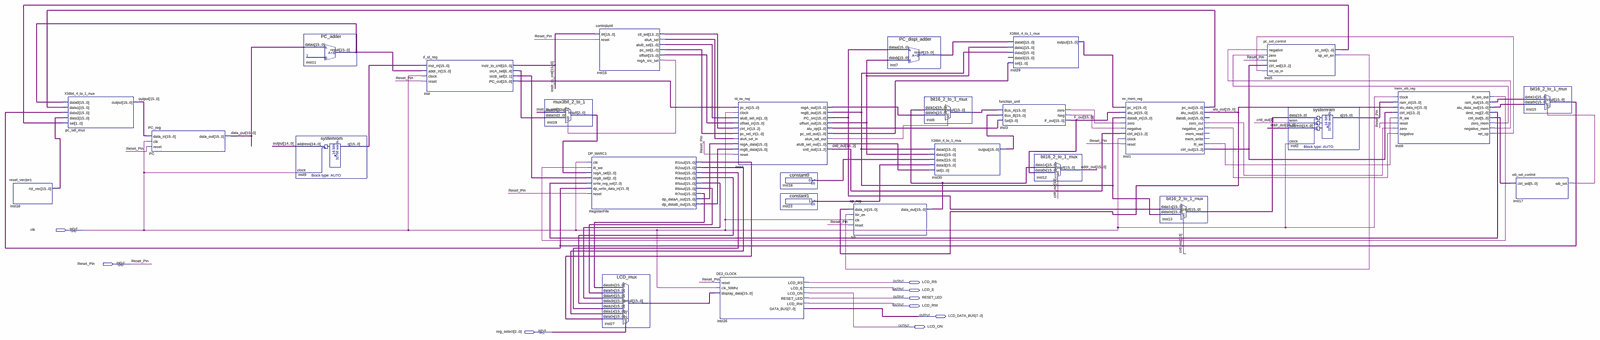
[diagram p0: schematic sheet, whole]
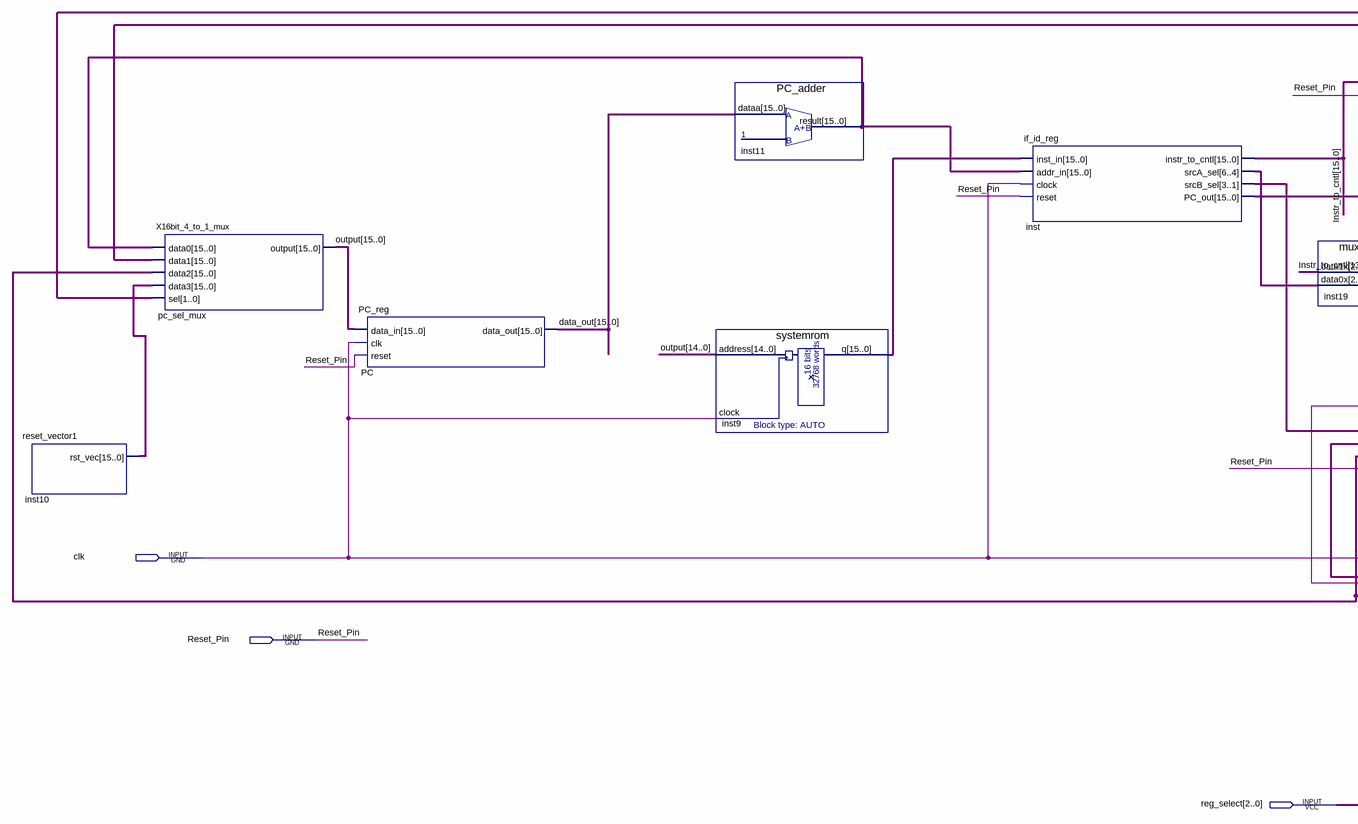
[diagram p1: schematic sheet, left part]
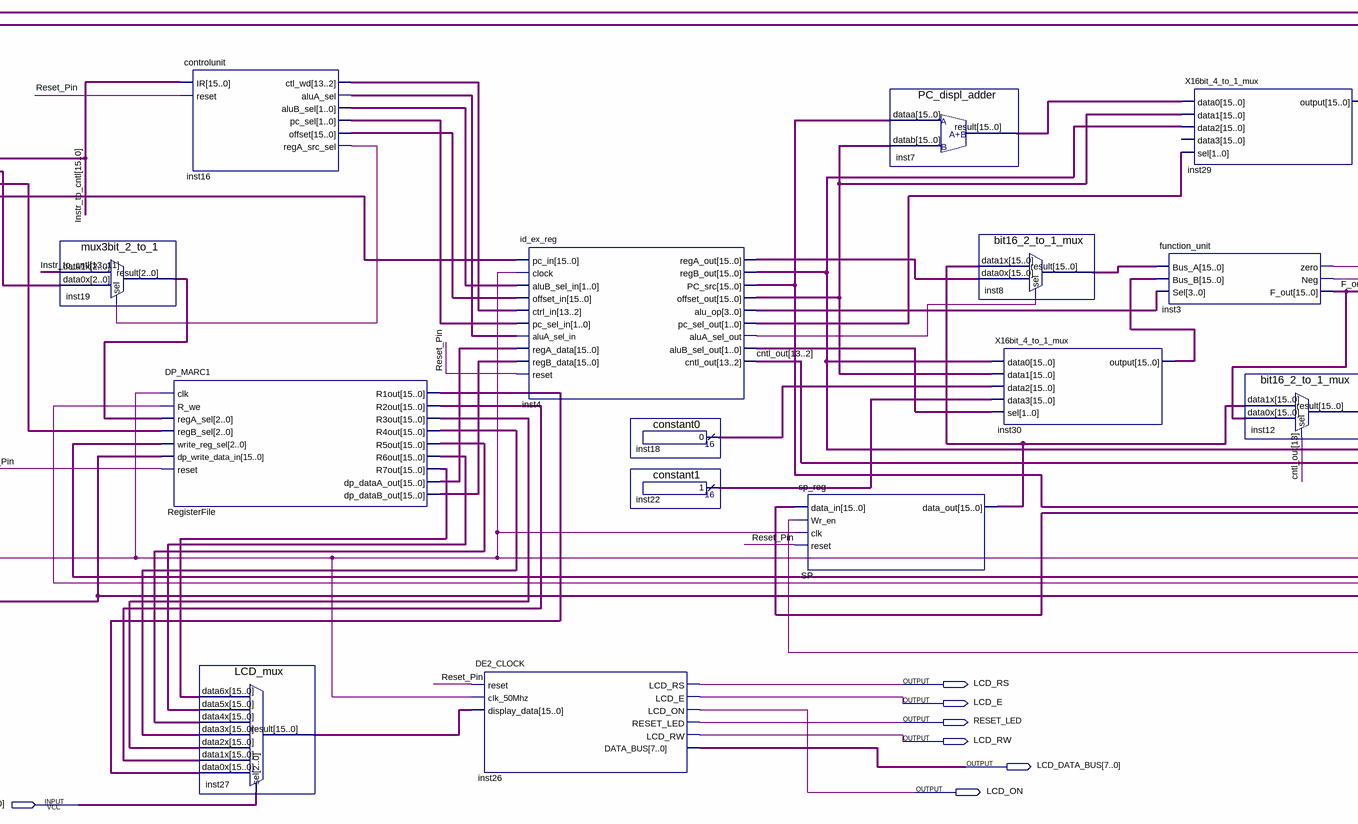
[diagram p2: schematic sheet, centre part]
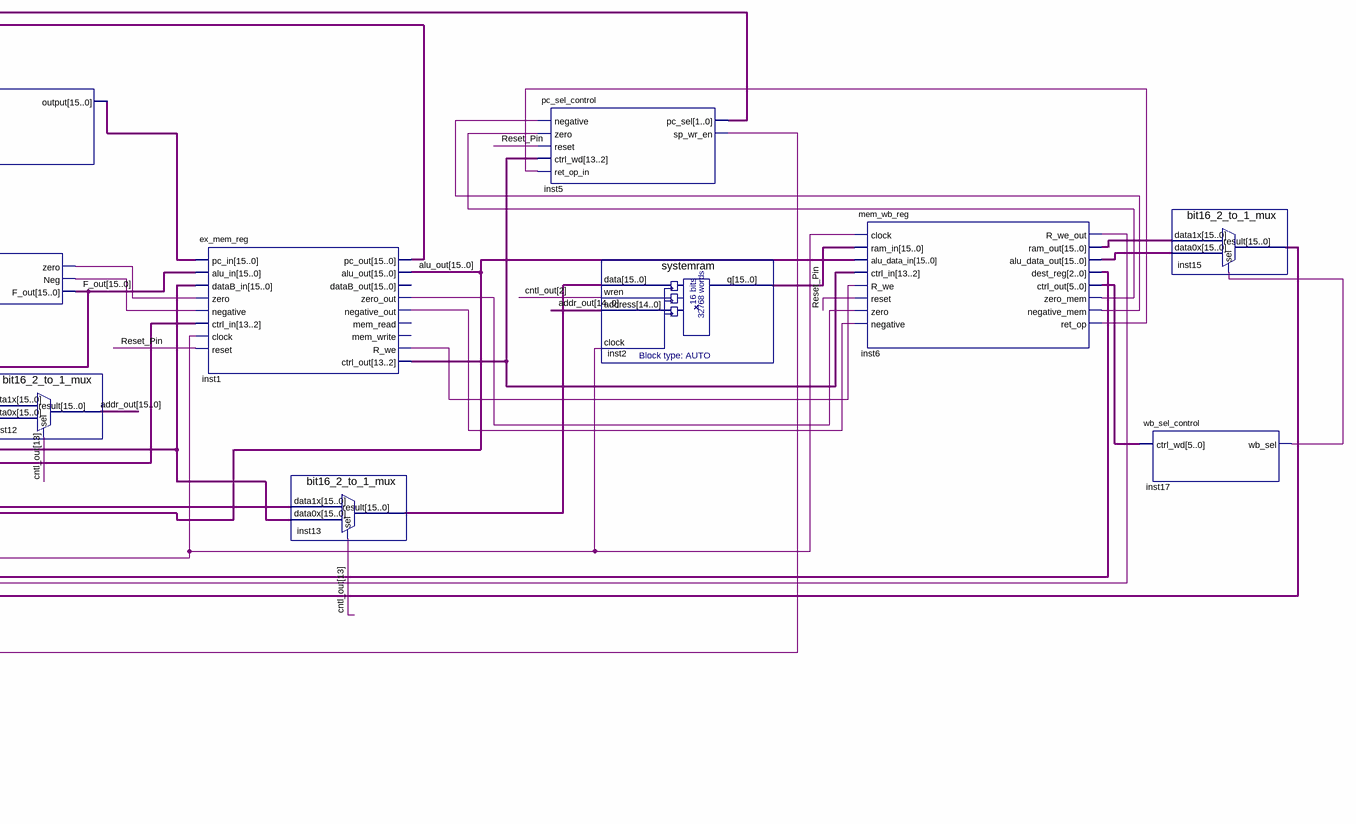
[diagram p3: schematic sheet, right part]
// Quartus schematic MARC3.bdf as structural Verilog: 28 symbols, 9 pins
module MARC3 (
  input  clk,
  input  Reset_Pin,
  input  [2:0] reg_select,
  output LCD_RS,
  output LCD_E,
  output RESET_LED,
  output LCD_RW,
  output [7:0] LCD_DATA_BUS,
  output LCD_ON
);

  wire inst1_negative_out, inst1_r_we, inst1_zero_out, inst3_neg, inst3_zero, inst4_alua_sel_out,
       inst5_sp_wr_en, inst6_negative_mem, inst6_r_we_out, inst6_ret_op, inst6_zero_mem, inst16_alua_sel,
       inst16_rega_src_sel, inst17_wb_sel;
  wire [1:0] inst4_alub_sel_out, inst4_pc_sel_out, inst5_pc_sel, inst16_alub_sel, inst16_pc_sel;
  wire [2:0] inst6_dest_reg, inst19_result, inst_srca_sel, inst_srcb_sel;
  wire [3:0] inst4_alu_op;
  wire [5:0] inst6_ctrl_out;
  wire [11:0] inst1_ctrl_out, inst16_ctl_wd;
  wire [13:2] cntl_out;
  wire [15:0] addr_out, alu_out, data_out, F_out, inst1_pc_out, inst2_q, inst4_offset_out, inst4_pc_src,
       inst4_rega_out, inst4_regb_out, inst6_alu_data_out, inst6_ram_out, inst7_result, inst8_result,
       inst9_q, inst10_rst_vec, inst11_result, inst13_result, inst15_result, inst16_offset, inst18_result,
       inst22_result, inst27_result, inst29_output, inst30_output, inst_pc_out, Instr_to_cntl, \output ,
       RegisterFile_dp_dataa_out, RegisterFile_dp_datab_out, RegisterFile_r1out, RegisterFile_r2out,
       RegisterFile_r3out, RegisterFile_r4out, RegisterFile_r5out, RegisterFile_r6out, RegisterFile_r7out,
       SP_data_out;

  reset_vector1 inst10 (.rst_vec(inst10_rst_vec));
  X16bit_4_to_1_mux pc_sel_mux (
    .data0(inst11_result), .data1(inst1_pc_out), .data2(inst15_result), .data3(inst10_rst_vec),
    .sel(inst5_pc_sel), .\output (\output ));
  PC_reg PC (.clk(clk), .data_in(\output ), .reset(Reset_Pin), .data_out(data_out));
  PC_adder inst11 (.dataa(data_out), .result(inst11_result));
  systemrom inst9 (.address(\output [14:0]), .clock(clk), .q(inst9_q));
  if_id_reg inst (
    .inst_in(inst9_q), .addr_in(inst11_result), .clock(clk), .reset(Reset_Pin),
    .instr_to_cntl(Instr_to_cntl), .srcA_sel(inst_srca_sel), .srcB_sel(inst_srcb_sel), .PC_out(inst_pc_out));
  mux3bit_2_to_1 inst19 (
    .data1x(Instr_to_cntl[13:11]), .data0x(inst_srca_sel), .sel(inst16_rega_src_sel), .result(inst19_result));
  controlunit inst16 (
    .IR(Instr_to_cntl), .reset(Reset_Pin), .ctl_wd(inst16_ctl_wd), .aluA_sel(inst16_alua_sel),
    .aluB_sel(inst16_alub_sel), .pc_sel(inst16_pc_sel), .offset(inst16_offset),
    .regA_src_sel(inst16_rega_src_sel));
  DP_MARC1 RegisterFile (
    .clk(clk), .R_we(inst6_r_we_out), .regA_sel(inst19_result), .regB_sel(inst_srcb_sel),
    .write_reg_sel(inst6_dest_reg), .dp_write_data_in(inst15_result), .reset(Reset_Pin),
    .R1out(RegisterFile_r1out), .R2out(RegisterFile_r2out), .R3out(RegisterFile_r3out),
    .R4out(RegisterFile_r4out), .R5out(RegisterFile_r5out), .R6out(RegisterFile_r6out),
    .R7out(RegisterFile_r7out), .dp_dataA_out(RegisterFile_dp_dataa_out),
    .dp_dataB_out(RegisterFile_dp_datab_out));
  LCD_mux inst27 (
    .data6x(RegisterFile_r7out), .data5x(RegisterFile_r6out), .data4x(RegisterFile_r5out),
    .data3x(RegisterFile_r4out), .data2x(RegisterFile_r3out), .data1x(RegisterFile_r2out),
    .data0x(RegisterFile_r1out), .sel(reg_select), .result(inst27_result));
  DE2_CLOCK inst26 (
    .reset(Reset_Pin), .clk_50Mhz(clk), .display_data(inst27_result), .LCD_RS(LCD_RS), .LCD_E(LCD_E),
    .LCD_ON(LCD_ON), .RESET_LED(RESET_LED), .LCD_RW(LCD_RW), .DATA_BUS(LCD_DATA_BUS));
  id_ex_reg inst4 (
    .pc_in(inst_pc_out), .clock(clk), .aluB_sel_in(inst16_alub_sel), .offset_in(inst16_offset),
    .ctrl_in(inst16_ctl_wd), .pc_sel_in(inst16_pc_sel), .aluA_sel_in(inst16_alua_sel),
    .regA_data(RegisterFile_dp_dataa_out), .regB_data(RegisterFile_dp_datab_out), .reset(Reset_Pin),
    .regA_out(inst4_rega_out), .regB_out(inst4_regb_out), .PC_src(inst4_pc_src),
    .offset_out(inst4_offset_out), .alu_op(inst4_alu_op), .pc_sel_out(inst4_pc_sel_out),
    .aluA_sel_out(inst4_alua_sel_out), .aluB_sel_out(inst4_alub_sel_out), .cntl_out(cntl_out));
  constant0 inst18 (.result(inst18_result));
  constant1 inst22 (.result(inst22_result));
  sp_reg SP (.data_in(alu_out), .Wr_en(inst5_sp_wr_en), .clk(clk), .reset(Reset_Pin), .data_out(SP_data_out));
  PC_displ_adder inst7 (.dataa(inst4_pc_src), .datab(inst4_offset_out), .result(inst7_result));
  bit16_2_to_1_mux inst8 (
    .data1x(SP_data_out), .data0x(inst4_rega_out), .sel(inst4_alua_sel_out), .result(inst8_result));
  X16bit_4_to_1_mux inst30 (
    .data0(inst4_regb_out), .data1(inst4_offset_out), .data2(inst18_result), .data3(inst22_result),
    .sel(inst4_alub_sel_out), .\output (inst30_output));
  function_unit inst3 (
    .Bus_A(inst8_result), .Bus_B(inst30_output), .Sel(inst4_alu_op), .zero(inst3_zero), .Neg(inst3_neg),
    .F_out(F_out));
  X16bit_4_to_1_mux inst29 (
    .data0(inst7_result), .data1(inst4_offset_out), .data2(inst4_regb_out), .sel(inst4_pc_sel_out),
    .\output (inst29_output));  // open: data3
  bit16_2_to_1_mux inst12 (.data1x(SP_data_out), .data0x(F_out), .sel(cntl_out[13]), .result(addr_out));
  ex_mem_reg inst1 (
    .pc_in(inst29_output), .alu_in(F_out), .dataB_in(inst4_regb_out), .zero(inst3_zero),
    .negative(inst3_neg), .ctrl_in(cntl_out), .clock(clk), .reset(Reset_Pin), .pc_out(inst1_pc_out),
    .alu_out(alu_out), .zero_out(inst1_zero_out), .negative_out(inst1_negative_out), .R_we(inst1_r_we),
    .ctrl_out(inst1_ctrl_out));  // open: dataB_out, mem_read, mem_write
  bit16_2_to_1_mux inst13 (.data1x(inst4_pc_src), .data0x(inst4_regb_out), .sel(cntl_out[13]), .result(inst13_result));
  pc_sel_control inst5 (
    .negative(inst6_negative_mem), .zero(inst6_zero_mem), .reset(Reset_Pin), .ctrl_wd(inst1_ctrl_out),
    .ret_op_in(inst6_ret_op), .pc_sel(inst5_pc_sel), .sp_wr_en(inst5_sp_wr_en));
  systemram inst2 (.data(inst13_result), .wren(cntl_out[2]), .address(addr_out[14:0]), .clock(clk), .q(inst2_q));
  mem_wb_reg inst6 (
    .clock(clk), .ram_in(inst2_q), .alu_data_in(alu_out), .ctrl_in(inst1_ctrl_out), .R_we(inst1_r_we),
    .reset(Reset_Pin), .zero(inst1_zero_out), .negative(inst1_negative_out), .R_we_out(inst6_r_we_out),
    .ram_out(inst6_ram_out), .alu_data_out(inst6_alu_data_out), .dest_reg(inst6_dest_reg),
    .ctrl_out(inst6_ctrl_out), .zero_mem(inst6_zero_mem), .negative_mem(inst6_negative_mem),
    .ret_op(inst6_ret_op));
  wb_sel_control inst17 (.ctrl_wd(inst6_ctrl_out), .wb_sel(inst17_wb_sel));
  bit16_2_to_1_mux inst15 (
    .data1x(inst6_ram_out), .data0x(inst6_alu_data_out), .sel(inst17_wb_sel), .result(inst15_result));
endmodule
